# EAGLE design master (EAGLE 9.6.2)
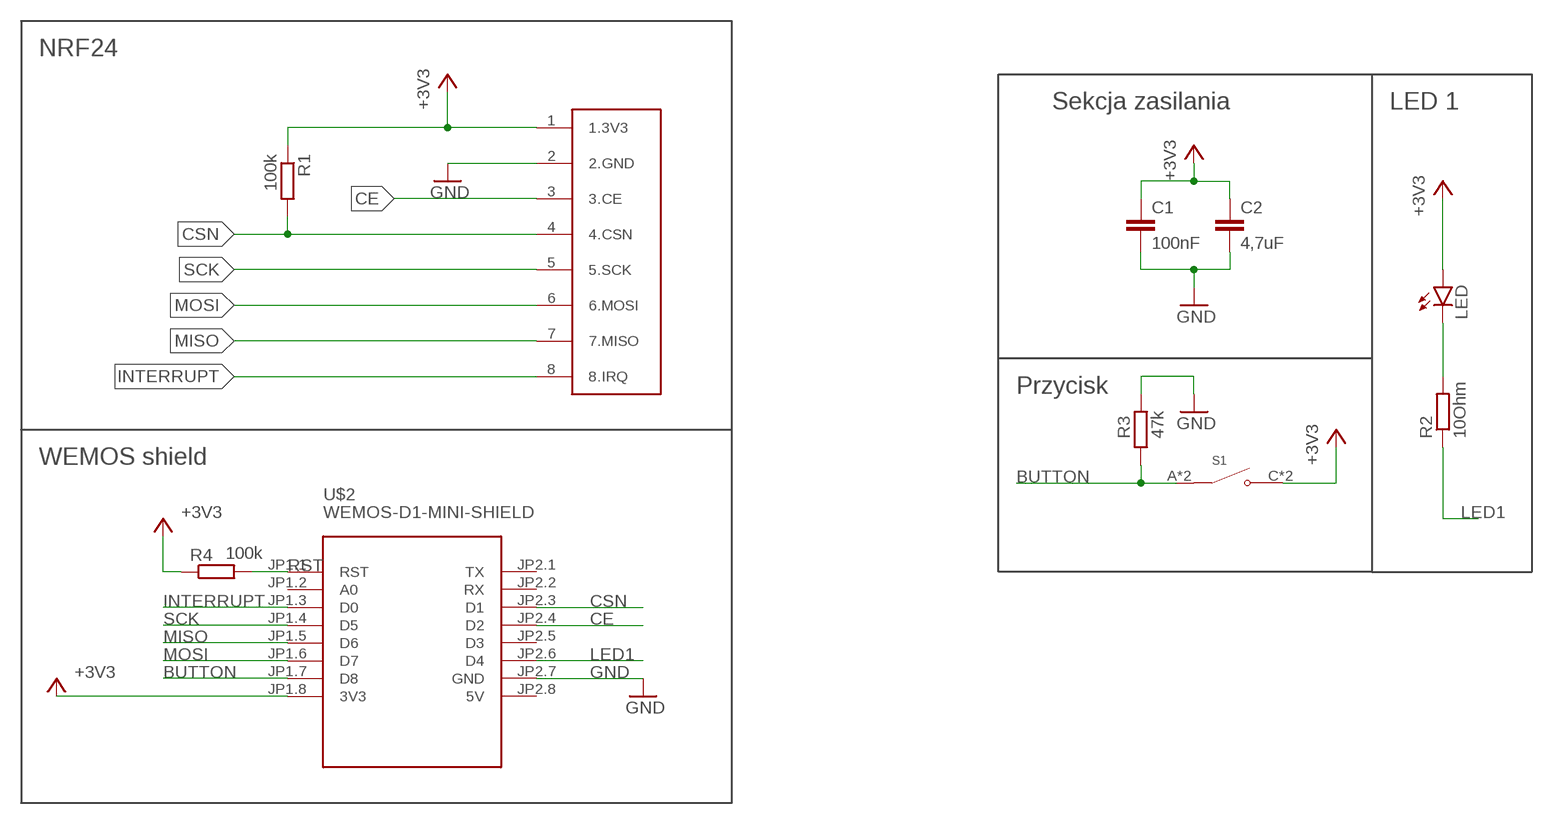
[diagram p0: schematic, sheet 1]

## Parts
C1  100nF  C-EUC0805  [C0805]
C2  4,7uF  C-EU025-050X050  [C025-050X050]
LED  LEDCHIP-LED0805  [CHIP-LED0805]
NRF24  NRF24L01+  [NRF24L01+]
R1  100k  R-EU_M0805  [M0805]
R2  10Ohm  R-EU_M0805  [M0805]
R3  47k  R-EU_M0805  [M0805]
R4  100k  R-EU_M0805  [M0805]
S1  TS-1187A-B-A-B  [SW_TS-1187A-B-A-B]
U$2  WEMOS-D1-MINI-SHIELD  [WEMOS-D1-MINI-SHIELD]

## Nets
+3V3 [vcc]: C1.1 C2.1 LED.A NRF24.1(1.3V3) R1.1 R4.1 S1.C(NO) S1.D(NO) U$2.JP1.8(3V3)
BUTTON: R3.1 S1.A(COM) S1.B(COM) U$2.JP1.7(D8)
CE: NRF24.3(3.CE) U$2.JP2.4(D2)
CSN: NRF24.4(4.CSN) R1.2 U$2.JP2.3(D1)
GND [vcc]: C1.2 C2.2 NRF24.2(2.GND) R3.2 U$2.JP2.7(GND)
INTERRUPT: NRF24.8(8.IRQ) U$2.JP1.3(D0)
LED1: R2.1 U$2.JP2.6(D4)
MISO: NRF24.7(7.MISO) U$2.JP1.5(D6)
MOSI: NRF24.6(6.MOSI) U$2.JP1.6(D7)
N$3: LED.C R2.2
RST: R4.2 U$2.JP1.1(RST)
SCK: NRF24.5(5.SCK) U$2.JP1.4(D5)
Unconnected: U$2.JP1.2(A0) U$2.JP2.1(TX) U$2.JP2.2(RX) U$2.JP2.5(D3)

## Notes on the sheet
- NRF24
- Sekcja zasilania | LED 1
- Przycisk
- WEMOS shield

## Power pins joined to a net without a drawn wire
5V: U$2.JP2.8(5V)

## Library data of the parts
C1 C2 = rcl:C-EU: CAPACITOR, European symbol; SPICEPREFIX: C
LED = led:LED: LED OSRAM: - CHIPLED LG R971, LG N971, LY N971, LG Q971, LY Q971, LO R971, LY R971 LH N974, LH R974 LS Q976, LO Q976, LY Q976 LO Q996 - Hyper CHIPLED LW Q18S LB Q993, LB Q99A, LB R99A - SideLED LS A670, LO A670, LY A670, LG A670, LP A670 LB A673, LV A673, LT A673, LW A673 LH A674 LY A675 LS A676, LA A676, LO A676, LY A676, LW A676 LS A679, LY A679, LG A679 - Hyper Micro SIDELED® LS Y876, LA Y876, LO Y876, LY Y876 LT Y87S - SmartLED LW L88C, LW L88S LB L89C, LB L89S, LG L890 LS L89K, LO L89K, LY L89K LS L896, LA L896, LO L896, LY L896 - TOPLED LS T670, LO T670, LY T670, LG T670, LP T670 LSG T670, LSP T670, LSY T670, LOP T670, LYG T670 LG T671, LOG T671, LSG T671 LB T673, LV T673, LT T673, LW T673 LH T674 LS T676, LA T676, LO T676, LY T676, LB T676, LH T676, LSB T676, LW T676 LB T67C, LV T67C, LT T67C, LS T67K, LO T67K, LY T67K, LW E67C LS E67B, LA E67B, LO E67B, LY E67B, LB E67C, LV E67C, LT E67C LW T67C LS T679, LY T679, LG T679 LS T770, LO T770, LY T770, LG T770, LP T770 LB T773, LV T773, LT T773, LW T773 LH T774 LS E675, LA E675, LY E675, LS T675 LS T776, LA T776, LO T776, LY T776, LB T776 LHGB T686 LT T68C, LB T68C - Hyper Mini TOPLED® LB M676 - Mini TOPLED Santana® LG M470 LS M47K, LO M47K, LY M47K Source: http://www.osram.convergy.de LUXEON: - LUMILED® LXK2-PW12-R00, LXK2-PW12-S00, LXK2-PW14-U00, LXK2-PW14-V00 LXK2-PM12-R00, LXK2-PM12-S00, LXK2-PM14-U00 LXK2-PE12-Q00, LXK2-PE12-R00, LXK2-PE12-S00, LXK2-PE14-T00, LXK2-PE14-U00 LXK2-PB12-K00, LXK2-PB12-L00, LXK2-PB12-M00, LXK2-PB14-N00, LXK2-PB14-P00, LXK2-PB14-Q00 LXK2-PR12-L00, LXK2-PR12-M00, LXK2-PR14-Q00, LXK2-PR14-R00 LXK2-PD12-Q00, LXK2-PD12-R00, LXK2-PD12-S00 LXK2-PH12-R00, LXK2-PH12-S00 LXK2-PL12-P00, LXK2-PL12-Q00, LXK2-PL12-R00 Source: www.luxeon.com KINGBRIGHT: KA-3528ASYC Source: www.kingbright.com
NRF24 = Modules:NRF24L01+: NRF24L01+
R1-R4 = rcl:R-EU_: RESISTOR, European symbol; SPICEPREFIX: R
S1 = Modules:TS-1187A-B-A-B: SPST tact switch
U$2 = diy-modules:WEMOS-D1-MINI-SHIELD: Template for WEMOS D1 mini compatible shields NOTICE: This is a template only. You can use it as a base to create symbols for WEMOS D1 mini compatible shields. Official list of available shields can be found here: https://www.wemos.cc/D1-mini-Shields

## Net classes
0 default: clearance 0.127 mm
1 vcc: width 0.5 mm, clearance 0.127 mm

## Board
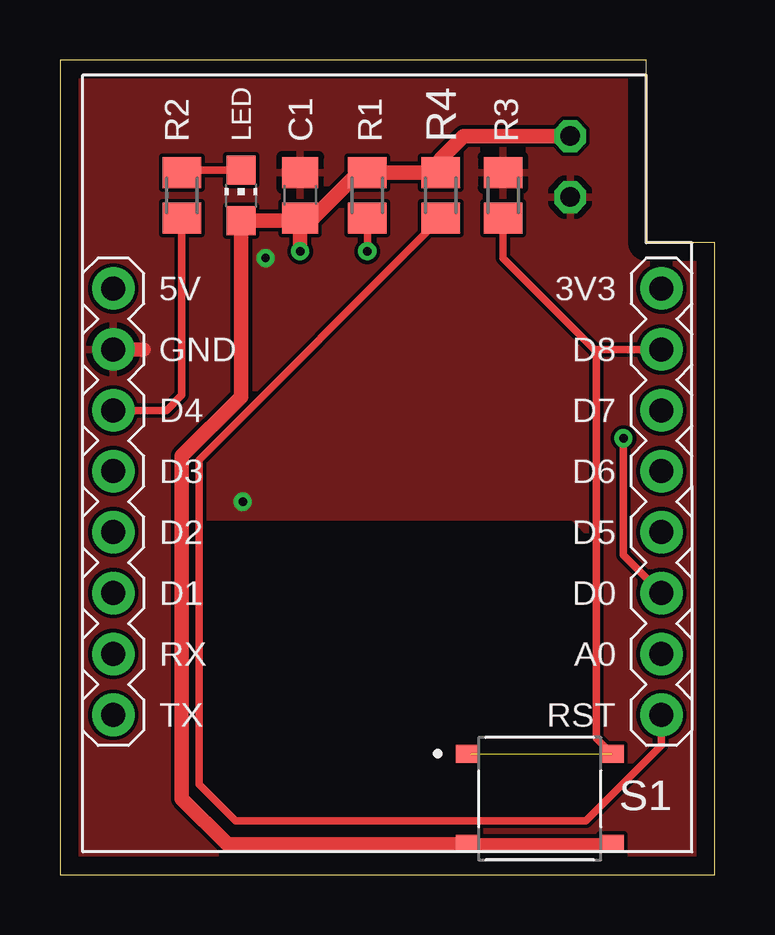
[diagram p1: board, top side]
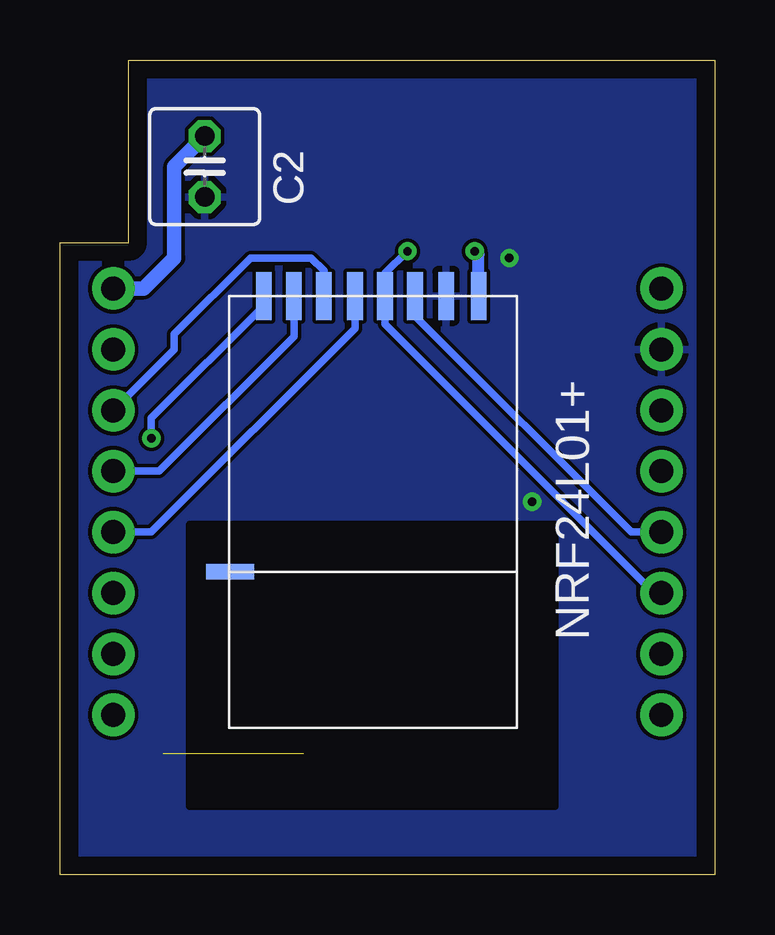
[diagram p2: board, bottom side, seen from below]

Size 27.3 x 33.97 mm. Coordinates in mm from the lower left corner, seen from the top.
Outline: 27.3,26.35 24.45,26.35 24.45,33.97 0,33.97 0,0 27.3,0 27.3,26.35
Copper layers (1*16): Top 0.035mm / dielectric 1.5mm / Bottom 0.035mm
Design rules "default *": minimum track width 6mil, minimum drill 0.35mm, track to track 6mil, track to pad 6mil, pad to pad 6mil, via to via 6mil, smd to smd 6mil, copper to edge 30mil, drill to drill 6mil, minimum pad ring 10mil, minimum via ring 8mil, stop-mask expansion 4mil, vias tented up to drill 0mil, thermal gap 10mil

### Footprints (pad centres in the part's own frame; a part is rotated, then mirrored left to right if it is on the bottom)
C0805 = smd 1.3 x 1.5: 1 -0.95,0; 2 0.95,0
C025-050X050 = drill 0.813 octagon: 1 -1.27,0; 2 1.27,0
CHIP-LED0805 = smd 1.2 x 1.2: A 0,-1.05; C 0,1.05
NRF24L01+ = smd 0.65 x 2: 1 1.6,0; 2 2.95,0; 3 4.25,0; 4 5.5,0; 5 6.75,0; 6 8.05,0; 7 9.3,0; 8 10.55,0 | smd 2 x 0.65: 9 11.96,11.49
M0805 = smd 1.3 x 1.6: 1 -0.95,0; 2 0.95,0
SW_TS-1187A-B-A-B = smd 1 x 0.75: A -3,1.875; B 3,1.875; C -3,-1.875; D 3,-1.875
WEMOS-D1-MINI-SHIELD = drill 1 pad 1.778: JP1.1 -11.43,12.065; JP1.2 -11.43,9.525; JP1.3 -11.43,6.985; JP1.4 -11.43,4.445; JP1.5 -11.43,1.905; JP1.6 -11.43,-0.635; JP1.7 -11.43,-3.175; JP1.8 -11.43,-5.715; JP2.1 11.43,12.065; JP2.2 11.43,9.525; JP2.3 11.43,6.985; JP2.4 11.43,4.445; JP2.5 11.43,1.905; JP2.6 11.43,-0.635; JP2.7 11.43,-3.175; JP2.8 11.43,-5.715

### Placement (x,y rotation side)
C1  10.01,28.33 90 top
C2  21.27,29.53 270 bottom
LED  7.55,28.33 0 top
NRF24  8.26,24.13 180 bottom
R1  12.81,28.33 270 top
R2  5.08,28.33 90 top
R3  18.47,28.33 90 top
R4  15.87,28.33 270 top
S1  20,3.17 0 top
U$2  13.65,18.73 180 top

### Tracks (layer width: path | path; a pad name or v marks a point on that pad's centre or on a via)
+3V3  (via drill 0.35)
  Top 0.5: S1.D S1.C 16.97,1.27
  Top 0.61: v10.02,26 C1.1 9.99,27.35 | 9.99,27.35 10.52,27.35 12.45,29.28 R1.1 R4.1 15.88,29.84 16.83,30.8 C2.1 | 9.99,27.35 9.89,27.35 9.81,27.28 LED.A 7.55,19.93 5.08,17.46 5.08,3.17 6.99,1.27 16.97,1.27
  Bottom 0.5: NRF24.1 9.86,25.88 v10.02,26
  Bottom 0.61: U$2.JP1.8 23.81,24.45 22.54,25.72 22.54,29.53 C2.1
BUTTON  (1 unrouted)
  Top 0.152: S1.A 17.14,5.05
  Top 0.305: U$2.JP1.7 22.37,21.91 | R3.1 18.47,25.72 22.28,21.91 22.37,21.91 | S1.B 22.37,5.68 22.37,21.91
CE
  Bottom 0.305: NRF24.3 12.51,23.3 3.49,14.29 U$2.JP2.4
CSN  (via drill 0.35)
  Top 0.305: R1.2 v12.81,26
  Bottom 0.305: U$2.JP2.3 2.54,11.75 13.76,22.96 NRF24.4 13.76,25.09 v12.81,26
GND  (via drill 0.35)
  Top 0.61: U$2.JP2.7 3.49,21.91
  other vias: 7.62,15.56 8.57,25.72
  pour Top: 0,0 0,34.29 27.3,34.29 27.3,0
  pour Bottom: 0,0 27.3,0 27.3,34.29 0,34.29
  cutout Top: 6.35,14.61 21.27,14.61 21.91,13.97 21.91,2.86 6.35,2.86
  cutout Bottom: 6.67,14.61 21.91,14.61 21.91,2.86 6.67,2.86
INTERRUPT  (via drill 0.35)
  Top 0.305: U$2.JP1.3 23.5,13.34 v23.5,18.2
  Bottom 0.305: NRF24.8 18.8,23.74 23.5,19.05 v23.5,18.2
LED1
  Top 0.305: U$2.JP2.6 4.45,19.37 5.08,20 R2.1
MISO
  Bottom 0.305: U$2.JP1.5 23.18,16.83 17.55,22.45 NRF24.7
MOSI
  Bottom 0.305: 16.41,24.24 NRF24.6 16.3,25.2 16.83,25.72 19.37,25.72 22.54,22.54 22.54,21.91 U$2.JP1.6
N$3
  Top 0.305: LED.C 5.18,29.38 R2.2
RST
  Top 0.305: R4.2 5.79,17.3 5.79,3.78 7.33,2.25 21.93,2.25 25.08,5.4 U$2.JP1.1
SCK
  Bottom 0.305: U$2.JP1.4 23.5,14.29 15.01,22.78 NRF24.5

### Text on the board
bPlace: NRF24L01+
opis_dol: by Dominik Nowocień v1.1
_tNames: R2 | LED | C1 | R1 | R4 | R3 | S1
_bNames: C2